# Altium schematic sheet PSU.SchDoc
size A4
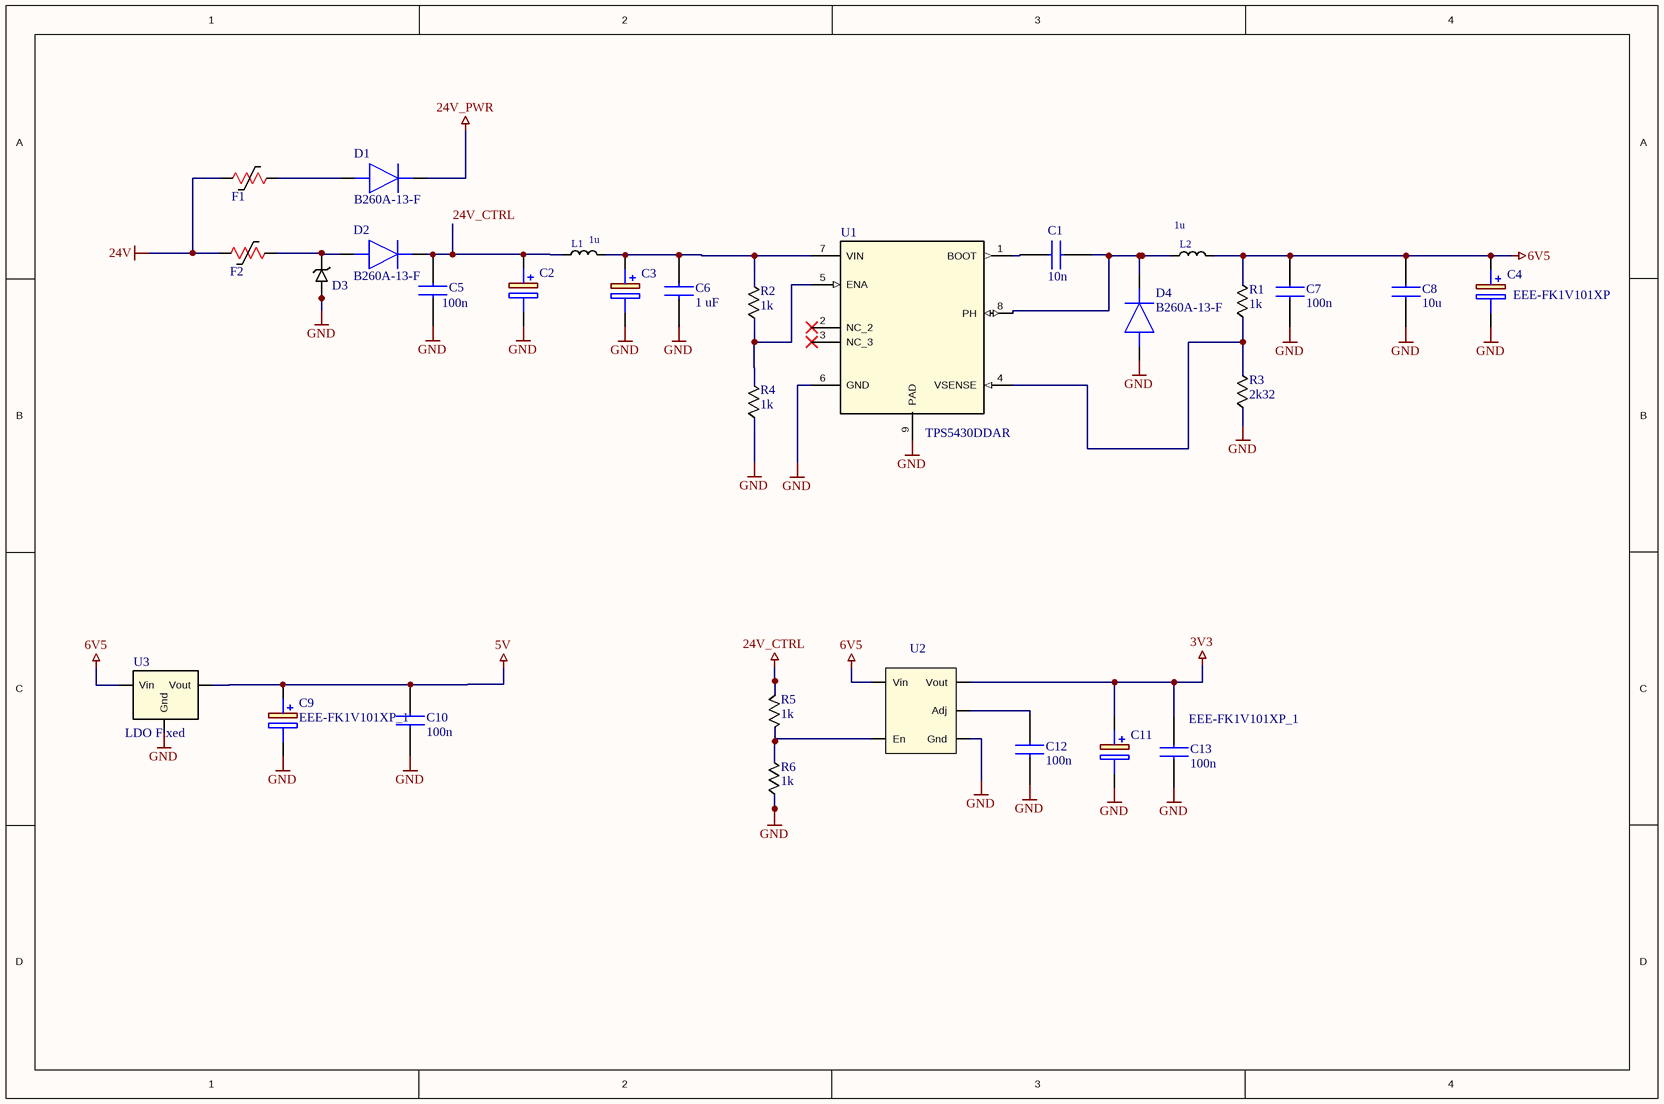
[diagram p0: PSU.SchDoc]

## Parts
C1  10n  [0603 CAP]
C2  EEE-FK1V101XP  [EEE0JA331XP]  (value not drawn)
C3  EEE-FK1V101XP  [EEE0JA331XP]  (value not drawn)
C4  EEE-FK1V101XP  [EEE0JA331XP]
C5  100n  [0603 CAP]
C6  1 uF  [0603 CAP]
C7  100n  [0603 CAP]
C8  10u  [0603 CAP]
C9  EEE-FK1V101XP_1  [EEE1AA220WR]
C10  100n  [0603 CAP]
C11  EEE-FK1V101XP_1  [EEE1AA220WR]
C12  100n  [0603 CAP]
C13  100n  [0603 CAP]
D1  B260A-13-F  [DO-214AC / SMA - POL]
D2  B260A-13-F  [DO-214AC / SMA - POL]
D3  TVS Diode  [DO-214AC / SMA - POL]  (value not drawn)
D4  B260A-13-F  [DO-214AC / SMA - POL]
F1  MF-USMF005-2  [MF-MSMF030-2]  (value not drawn)
F2  MF-USMF005-2  [MF-MSMF030-2]  (value not drawn)
L1  1u  [CDRH127/LDNP]
L2  1u  [cdRH127/LDNP]
R1  1k  [0603 CAP]
R2  1k  [0603 CAP]
R3  2k32  [0603 CAP]
R4  1k  [0603 CAP]
R5  1k  [0603 CAP]
R6  1k  [0603 CAP]
U1  TPS5430DDAR  [SOIC8 pad]
U2  LDO with Enable Pin  [SOT-23-5]  (value not drawn)
U3  LDO Fixed  [SOT-223]

## Nets
3V3: C11.1(+) C13.2 U2.5(Vout)
5V: C9.1(+) C10.2 U3.2(Vout)
6V5: C4.1(+) C7.2 C8.2 L2.2 R1.2 U2.1(Vin) U3.3(Vin)
24V: F1.2 F2.2
24V_CTRL: C2.1(+) C5.2 D2.2(K) L1.1 R5.1
24V_PWR: D1.2(K)
GND: C2.2(-) C3.2(-) C4.2(-) C5.1 C6.1 C7.1 C8.1 C9.2(-) C10.1 C11.2(-) C12.1 C13.1 D3.1 D4.1(A) R3.1 R4.1 R6.1 U1.6(GND) U1.9(PAD) U2.2(Gnd) U3.1(Gnd)
NetC1_1: C1.1 U1.1(BOOT)
NetC1_2: C1.2 D4.2(K) L2.1 U1.8(PH)
NetC3_1: C3.1(+) C6.2 L1.2 R2.2 U1.7(VIN)
NetC12_2: C12.2 U2.4(Adj)
NetD1_1: D1.1(A) F1.1
NetD2_1: D2.1(A) D3.2 F2.1
NetR1_1: R1.1 R3.2 U1.4(VSENSE)
NetR2_1: R2.1 R4.2 U1.5(ENA)
NetR5_2: R5.2 R6.2 U2.3(En)

Not connected (* = marked no-connect by the designer): U1 2(NC_2)* 3(NC_3)*

## Library data of the parts
C1 = 0603 CAP: GRM188R72A103KA01D; Manufacturer_Name: Murata Electronics; Datasheet Link: https://search.murata.co.jp/Ceramy/image/img/A01X/G101/ENG/GRM188R72A103KA01-01A.pdf; Height: 0.9mm; Manufacturer_Part_Number: GRM188R72A103KA01D; Mouser Part Number: 81-GRM188R72A103KA1D; Mouser Price/Stock: https://www.mouser.co.uk/ProductDetail/Murata-Electronics/GRM188R72A103KA01D?qs=krk%2F6UQjCzAtl9phuocbug%3D%3D; Arrow Part Number: GRM188R72A103KA01D; Arrow Price/Stock: https://www.arrow.com/en/products/grm188r72a103ka01d/murata-manufacturing?region=europe
C2-C4 = EEE-FK1V101XP: Capacitor Polarised; Manufacturer_Name: Panasonic; Datasheet Link: http://industrial.panasonic.com/cdbs/www-data/pdf/RDE0000/ABA0000C1181.pdf; Height: 7.8mm; Manufacturer_Part_Number: EEE-FK1V101XP; Mouser Part Number: 667-EEE-FK1V101XP; Mouser Price/Stock: https://www.mouser.co.uk/ProductDetail/Panasonic/EEE-FK1V101XP?qs=qE6bgDGEOCu46KIpIgG5Yw%3D%3D; Arrow Part Number: EEE-FK1V101XP; Arrow Price/Stock: https://www.arrow.com/en/products/eee-fk1v101xp/panasonic?utm_currency=USD&region=europe
C5 C7 C10 C12 C13 = 0603 CAP: CC0603KRX7R9BB104; Manufacturer_Name: Murata Electronics; Manufacturer_Part_Number: GRM188R72A103KA01D; Datasheet Link: https://search.murata.co.jp/Ceramy/image/img/A01X/G101/ENG/GRM188R72A103KA01-01A.pdf; Height: 0.9mm; Mouser Part Number: 81-GRM188R72A103KA1D; Mouser Price/Stock: https://www.mouser.co.uk/ProductDetail/Murata-Electronics/GRM188R72A103KA01D?qs=krk%2F6UQjCzAtl9phuocbug%3D%3D; Arrow Part Number: GRM188R72A103KA01D; Arrow Price/Stock: https://www.arrow.com/en/products/grm188r72a103ka01d/murata-manufacturing?region=europe
C6 = 0603 CAP: CC0603KRX7R9BB105; Manufacturer_Name: Murata Electronics; Manufacturer_Part_Number: GRM188R72A103KA01D; Datasheet Link: https://search.murata.co.jp/Ceramy/image/img/A01X/G101/ENG/GRM188R72A103KA01-01A.pdf; Height: 0.9mm; Mouser Part Number: 81-GRM188R72A103KA1D; Mouser Price/Stock: https://www.mouser.co.uk/ProductDetail/Murata-Electronics/GRM188R72A103KA01D?qs=krk%2F6UQjCzAtl9phuocbug%3D%3D; Arrow Part Number: GRM188R72A103KA01D; Arrow Price/Stock: https://www.arrow.com/en/products/grm188r72a103ka01d/murata-manufacturing?region=europe
C8 = 0603 CAP: GRM188R61E105KA12D; Manufacturer_Name: Murata Electronics; Manufacturer_Part_Number: GRM188R72A103KA01D; Datasheet Link: https://search.murata.co.jp/Ceramy/image/img/A01X/G101/ENG/GRM188R72A103KA01-01A.pdf; Height: 0.9mm; Mouser Part Number: 81-GRM188R72A103KA1D; Mouser Price/Stock: https://www.mouser.co.uk/ProductDetail/Murata-Electronics/GRM188R72A103KA01D?qs=krk%2F6UQjCzAtl9phuocbug%3D%3D; Arrow Part Number: GRM188R72A103KA01D; Arrow Price/Stock: https://www.arrow.com/en/products/grm188r72a103ka01d/murata-manufacturing?region=europe
C9 C11 = EEE-FK1V101XP_1: EEEFK1C100R; Manufacturer_Name: Panasonic; Datasheet Link: http://industrial.panasonic.com/cdbs/www-data/pdf/RDE0000/ABA0000C1181.pdf; Height: 7.8mm; Manufacturer_Part_Number: EEE-FK1V101XP; Mouser Part Number: 667-EEE-FK1V101XP; Mouser Price/Stock: https://www.mouser.co.uk/ProductDetail/Panasonic/EEE-FK1V101XP?qs=qE6bgDGEOCu46KIpIgG5Yw%3D%3D; Arrow Part Number: EEE-FK1V101XP; Arrow Price/Stock: https://www.arrow.com/en/products/eee-fk1v101xp/panasonic?utm_currency=USD&region=europe
D1 D2 D4 = B260A-13-F: Diode; Manufacturer_Name: Diodes Incorporated; Datasheet Link: https://componentsearchengine.com/Datasheets/2/B260A-13-F.pdf; Height: 2.3mm; Manufacturer_Part_Number: B260A-13-F; Mouser Part Number: 621-B260A-F; Mouser Price/Stock: https://www.mouser.co.uk/ProductDetail/Diodes-Incorporated/B260A-13-F?qs=9XwZYT68TnR%252B3fnyovGFLA%3D%3D; Arrow Part Number: B260A-13-F; Arrow Price/Stock: https://www.arrow.com/en/products/b260a-13-f/diodes-incorporated?region=nac
D3 = TVS_1_Uni: TVS Protective Diode Uni
F1 F2 = Fuse Resettable: Resettable Fuse Polyswitch
L1 L2 = Inductor CDRH127: SMD 0805; Value: 1u
R1 R2 R4-R6 = 0603 RES
R3 = RES 0603: RC0603FR-072K32L
U2 = LM8805
U3 = LDO Fixed S